# Altium project AC-DC-Supply-M1.PrjPcb
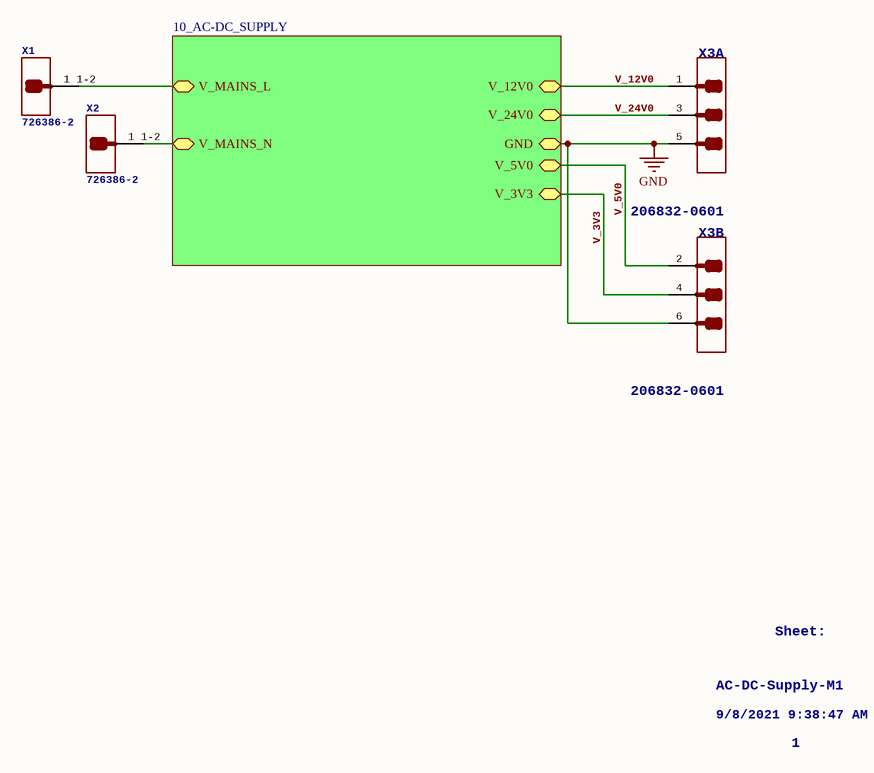
[diagram p0: AC-DC-Supply-M1.SchDoc]
2 sheets, 58 parts. Net scope: hierarchical (ports join the sheet entries above them; power ports are global).
Board file: AC-DC-Supply-M1.PcbDoc
Sheets:
  AC-DC-Supply-M1.SchDoc
    10_AC-DC_SUPPLY = AC-DC_SUPPLY.SchDoc

## Sheet AC-DC-Supply-M1.SchDoc: AC-DC-Supply-M1
size 282 x 208 mm; Date: 9/8/2021 9:38:47 AM; SheetNumber: 1; GateName_1: G$1; SymbolName_1: A4L-LOC; LibraryName: frames; DeviceSetName: A4L-LOC; Sheet: Sheet:

### Parts
X1  726386-2  [TE_726386-2_MODIFIED]
X2  726386-2  [TE_726386-2_MODIFIED]
X3  MOLEX_206832-0601MOLEX_206832-0601  [MOLEX_206832-0601]  (value not drawn)  (parts A,B of 2)

### Sub-sheets
10_AC-DC_SUPPLY = AC-DC_SUPPLY.SchDoc: V_MAINS_L (bidir), V_MAINS_N (bidir), V_24V0 (bidir), V_12V0 (bidir), V_5V0 (bidir), V_3V3 (bidir), GND (bidir)

### Nets
GND: X3.5 X3.6 ; sheet 10_AC-DC_SUPPLY/GND
V_3V3: X3.4 ; sheet 10_AC-DC_SUPPLY/V_3V3
V_5V0: X3.2 ; sheet 10_AC-DC_SUPPLY/V_5V0
V_12V0: X3.1 ; sheet 10_AC-DC_SUPPLY/V_12V0
V_24V0: X3.3 ; sheet 10_AC-DC_SUPPLY/V_24V0
NetC1_1: X1.1_1-2 ; sheet 10_AC-DC_SUPPLY/V_MAINS_L
NetC1_2: X2.1_1-2 ; sheet 10_AC-DC_SUPPLY/V_MAINS_N

### Notes on the sheet
- Sheet:
- AC-DC-Supply-M1
- 9/8/2021 9:38:47 AM
- 1
- 2
- 3
- 4
- 5
- 6
- A
- B
- C
- D

### Library data of the parts
X1 X2 = 726386-2: Terminals, Faston, GDS-Flachstecker 6.3x0.8mm, TE; MFR: TE Connectivity; PART_VALUE: 6.35mmx8mm; GateName_1: G$0; DESCRIPTION: 0.250" (6.35mm) Quick Connect Male - Solder Connector Non-Insulated; SymbolName_1: 726386-2; LibraryName: Labops_Lib_AH; DeviceSetName: 726386-2; MFN: 726386-2; PRICE-1: 0.24; SUPPLIER-1: Digikey
X3 = MOLEX_206832-0601MOLEX_206832-0601: Connector Header Through Hole 6 position 0.118" (3.00mm); MFR: Molex; PART_VALUE: 6CCT x 2Row; GateName_1: A; SymbolName_1: MOLEX_206832-0601_0_0; GateName_2: B; SymbolName_2: MOLEX_206832-0601_0_1; DESCRIPTION: Connector Header Through Hole 6 position 3mm Microfit; LIB_STATUS: Prototype; OUR_STOCK: 20; DeviceName: MOLEX_206832-0601; LibraryName: Labops_Lib_AH; DeviceSetName: MOLEX_206832-0601; 206832-0601: 206832-0601; MFN: 206832-0601; PRICE-1: 1.32; SUPPLIER-1: Digikey

## Sheet AC-DC_SUPPLY.SchDoc: AC-DC-Supply-M1
size 282 x 220 mm; Date: 9/8/2021 9:38:51 AM; SheetNumber: 1; GateName_1: G$1; SymbolName_1: A4L-LOC; LibraryName: frames; DeviceSetName: A4L-LOC; Sheet: Sheet:
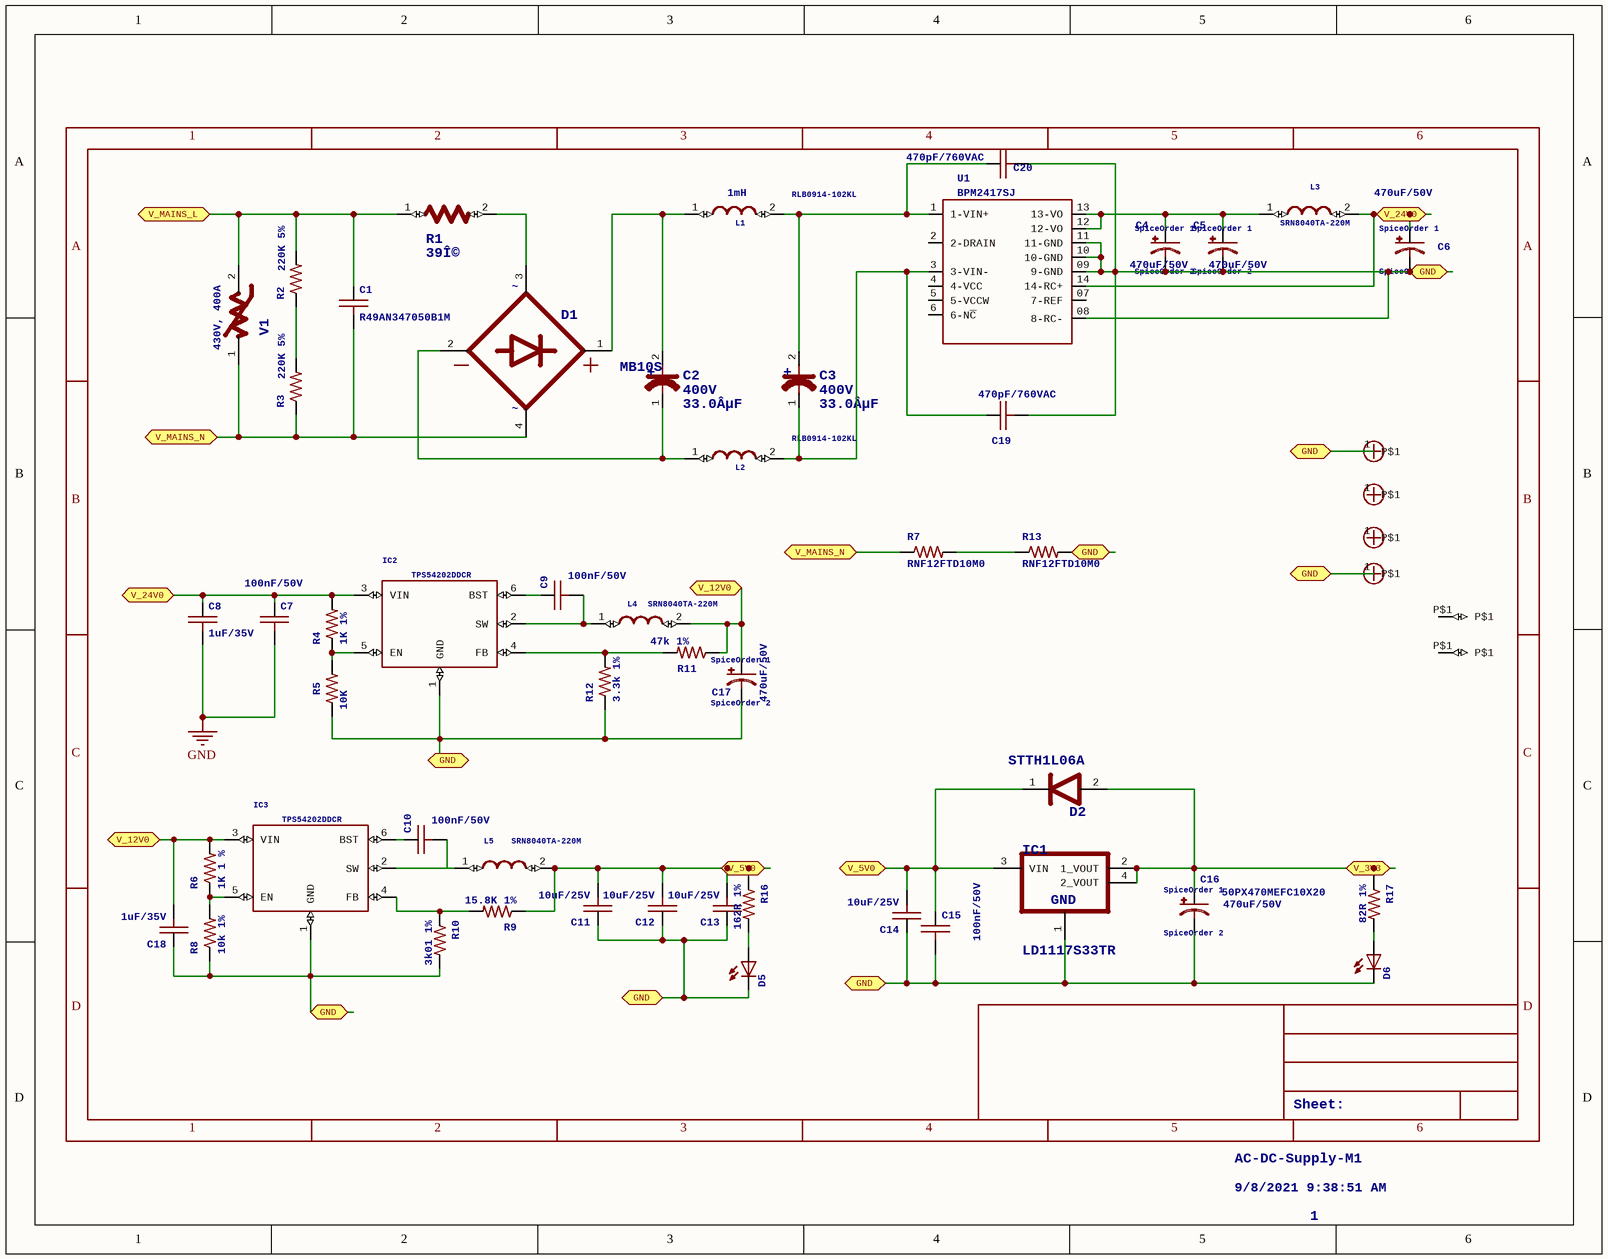
[diagram p1: AC-DC_SUPPLY.SchDoc]

### Parts
C1  R49AN347050B1M  [R49AN347050B1M]
C2  860011378008  [RADIAL_D13.0P5.0H25.0]  (value not drawn)
C3  860011378008  [RADIAL_D13.0P5.0H25.0]  (value not drawn)
C4  SpiceOrder1: SpiceOrder 1  SpiceOrder2: SpiceOrder 2  PART_VALUE: 470uF/50V  [CAPACITOR-ELKO-RM5-10X16]  (hidden comment: 50PX470MEFC10X20)
C5  SpiceOrder1: SpiceOrder 1  SpiceOrder2: SpiceOrder 2  PART_VALUE: 470uF/50V  [CAPACITOR-ELKO-RM5-10X16]  (hidden comment: 50PX470MEFC10X20)
C6  SpiceOrder1: SpiceOrder 1  SpiceOrder2: SpiceOrder 2  PART_VALUE: 470uF/50V  [CAPACITOR-ELKO-RM5-10X16]  (hidden comment: 50PX470MEFC10X20)
C7  100nF/50V  [0603]
C8  1uF/35V  [0603]
C9  100nF/50V  [0603]
C10  100nF/50V  [0603]
C11  10uF/25V  [0603]
C12  10uF/25V  [0603]
C13  10uF/25V  [0603]
C14  10uF/25V  [0603]
C15  100nF/50V  [0603]
C16  50PX470MEFC10X20  SpiceOrder1: SpiceOrder 1  SpiceOrder2: SpiceOrder 2  PART_VALUE: 470uF/50V  [CAPACITOR-ELKO-RM5-10X16]
C17  SpiceOrder1: SpiceOrder 1  SpiceOrder2: SpiceOrder 2  PART_VALUE: 470uF/50V  [CAPACITOR-ELKO-RM5-10X16]  (hidden comment: 50PX470MEFC10X20)
C18  1uF/35V  [0603]
C19  PART_VALUE: 470pF/760VAC  [CAP-P12.5-H15-W4-D1]  (hidden comment: ERP610W471MEF0)
C20  PART_VALUE: 470pF/760VAC  [CAP-P12.5-H15-W4-D1]  (hidden comment: ERP610W471MEF0)
D1  MB10S  [SOIC4W]
D2  STTH1L06ASTMICROELECTRONICS_STTH1L06A_0_0  [SMA_STTH1L06A]  (value not drawn)
D5  26-21/GPC-F3138B/CA  [SMD1206-LED]  (value not drawn)
D6  26-21/GPC-F3138B/CA  [SMD1206-LED]  (value not drawn)
FID1  FIDUCIAL  [FIDUCIAL]  (value not drawn)
FID2  FIDUCIAL  [FIDUCIAL]  (value not drawn)
IC1  LD1117S33TR  [SOT223_LD1117S33TR]
IC2  TPS54202DDCR  [SOT23-6]
IC3  TPS54202DDCR  [SOT23-6]
L1  RLB0914-102KL  PART_VALUE: 1mH  [THTINDUCTOR8MM7]
L2  RLB0914-102KL  [THTINDUCTOR8MM7]
L3  SRN8040TA-220M  [SRN8040TA-220M]
L4  SRN8040TA-220M  [SRN8040TA-220M]
L5  SRN8040TA-220M  [SRN8040TA-220M]
M1  M_HOLE_3M  [PCB_SCREW_M3_POWER]  (value not drawn)
M2  M_HOLE_3M  [PCB_SCREW_M3_POWER]  (value not drawn)
M3  M_HOLE_3M  [PCB_SCREW_M3_POWER]  (value not drawn)
M4  M_HOLE_3M  [PCB_SCREW_M3_POWER]  (value not drawn)
R1  ERG-2SJ390V  [ERG-2SJ390V_0]  (value not drawn)
R2  PART_VALUE: 220K 5%  [R1206]  (hidden comment: R_1206)
R3  PART_VALUE: 220K 5%  [R1206]  (hidden comment: R_1206)
R4  1K 1%  [R0603]
R5  10K  [R0603]
R6  1K 1 %  [R0603]
R7  RNF12FTD10M0  [RES-RM12.5-VR37]
R8  10k 1%  [R0603]
R9  15.8K 1%  [R0603]
R10  3k01 1%  [R0603]
R11  47k 1%  [R0603]
R12  3.3k 1%  [R0603]
R13  RNF12FTD10M0  [RES-RM12.5-VR37]
R16  162R 1%  [R0603]
R17  82R 1%  [R0603]
U1  BPM2417SJ  [BPM2417SJ]
V1  PART_VALUE: 430V, 400A  [EPCOS_B72205S0271K101_0]  (hidden comment: B72205S0271K101)

### Ports
GND, V_3V3, V_5V0, V_12V0, V_24V0, V_MAINS_L, V_MAINS_N

### Nets
GND: C4.2(-) C5.2(-) C6.2(-) C7.2 C8.2 C11.1 C12.1 C13.1 C14.1 C15.2 C16.2(-) C17.2(-) C18.1 C19.P$2 C20.P$2 D5.2(C) D6.2(C) IC1.1(GND) IC2.1(GND) IC3.1(GND) M1.1(P$1) M4.1(P$1) R5.1 R8.1 R10.2 R12.1 R13.2 U1.08(8-RC-) U1.09(9-GND) U1.10(10-GND) U1.11(11-GND) ; port GND
V_3V3: C16.1(+) D2.2(ANODE) IC1.2(1_VOUT) IC1.4(2_VOUT) R17.1 ; port V_3V3
V_5V0: C11.2 C12.2 C13.2 C14.2 C15.1 D2.1(CATHODE) IC1.3(VIN) L5.2(P$2) R9.1 R16.1 ; port V_5V0
V_12V0: C17.1(+) C18.2 IC3.3(VIN) L4.2(P$2) R6.2 R11.1 ; port V_12V0
V_24V0: C6.1(+) C7.1 C8.1 IC2.3(VIN) L3.2(P$2) R4.2 U1.14(14-RC+) ; port V_24V0
NetC1_1: C1.1 R1.1 R2.2 V1.2 ; port V_MAINS_L
NetC1_2: C1.2 D1.4(2_~) R3.1 R7.1 V1.1 ; port V_MAINS_N
NetC2_1: C2.1(CATHODE) D1.2(-) L2.1(P$1)
NetC2_2: C2.2(ANODE) D1.1(+) L1.1(P$1)
NetC3_1: C3.1(CATHODE) C19.P$1 L2.2(P$2) U1.3(3-VIN-)
NetC3_2: C3.2(ANODE) C20.P$1 L1.2(P$2) U1.1(1-VIN+)
NetC4_1: C4.1(+) C5.1(+) L3.1(P$1) U1.12(12-VO) U1.13(13-VO)
NetC9_1: C9.1 IC2.6(BST)
NetC9_2: C9.2 IC2.2(SW) L4.1(P$1)
NetC10_1: C10.1 IC3.6(BST)
NetC10_2: C10.2 IC3.2(SW) L5.1(P$1)
NetD1_3: D1.3(1_~) R1.2
NetD5_1: D5.1(A) R16.2
NetD6_1: D6.1(A) R17.2
NetIC2_4: IC2.4(FB) R11.2 R12.2
NetIC2_5: IC2.5(EN) R4.1 R5.2
NetIC3_4: IC3.4(FB) R9.2 R10.1
NetIC3_5: IC3.5(EN) R6.1 R8.2
NetR2_1: R2.1 R3.2
NetR7_2: R7.2 R13.1

Not connected (* = marked no-connect by the designer): FID1 P$1; FID2 P$1; M2 1(P$1); M3 1(P$1); U1 2(2-DRAIN) 4(4-VCC) 5(5-VCCW) 6(6-N~{C}) 07(7-REF)

### Notes on the sheet
- Sheet:
- AC-DC-Supply-M1
- 9/8/2021 9:38:51 AM
- 1
- 2
- 3
- 4
- 5
- 6
- A
- B
- C
- D

### Library data of the parts
C1 = R49AN347050B1M: 0.47ÂµF X Cap 330V 800V Polypropylene (PP), Metallized Radial; MFR: Kemet; PART_VALUE: 470nF/330VAC; GateName_1: G$1; SymbolName_1: CAP_NON_POLARIZED; DESCRIPTION: Film,X1,470nF/330Vac,THT; LIB_STATUS: Verified; OUR_STOCK: 8; LibraryName: Labops_Lib_AH; DeviceSetName: R49AN347050B1M; MFN: R49AN347050B1M; PRICE-1: 1.51; SUPPLIER-1: Digikey
C2 C3 = 860011378008: Aluminium Electrolytic Capacitor, WCAP-ATG8 Series, 33 F, 20%, 400 V, 13 mm, Radial Leaded; MFR: Wurth Elektronik; PART_VALUE: 33uF/400V; GateName_1: G$0; SymbolName_1: WURTH_860011378008_0_0; DESCRIPTION: Electrolytic Cap 33µF 400V 13mm Radial WCAP-ATG8; Lifetime 2000h +85°C; LIB_STATUS: Verified; OUR_STOCK: 4; LibraryName: Labops_Lib_AH; DeviceSetName: 860011378008; 33.0ÂµF: 33.0ÂµF; +: +; 400V: 400V; MFN: 860011378008; SUPPLIER-1: Digikey
C4-C6 C16 C17 = 50PX470MEFC10X20: Electrolytic Cap, 470ÂµF, 25V, Low ESR, Kemet, Pitch=5mm, Dia=10mm, L=12,5mm; MFR: Rubicon; GateName_1: G$1; SymbolName_1: CAP_POLARIZED; DESCRIPTION: 470uF ±20% 50V 10mm 20mm 5mm 2000Hrs; LIB_STATUS: Prototype; OUR_STOCK: 20; LibraryName: Labops_Lib_AH; DeviceSetName: 50PX470MEFC10X20; MFN: 50PX470MEFC10X20; PRICE-1: 0.14; SUPPLIER-1: LCSC; TECHNOLOGY: THT
C7-C15 C18 = C_0603: GateName_1: G$1; SymbolName_1: CAP_NON_POLARIZED; MFN: Open Source; LibraryName: Labops_Lib_AH; DeviceSetName: C_0603; DESCRIPTION: *; MFR: *; OUR-STOCK: *; PART_VALUE: *; PRICE-1: *; SUPPLIER-1: *
C19 C20 = ERP610W471MEF0: MFR: Kemet; GateName_1: G$1; SymbolName_1: CAP_NON_POLARIZED; DESCRIPTION: 470 pF ±20% 760VAC Ceramic Capacitor Y5U (E) Radial X1,Y1; LIB_STATUS: Prototype; OUR_STOCK: 150; LibraryName: Labops_Lib_AH; DeviceSetName: ERP610W471MEF0; MFN: ERP610W471MEF0; PRICE-1: 0.42; SUPPLIER-1: Digikey
D1 = MB10S: MFR: On Semi, Diodes,MDD; PART_VALUE: Bridge Rectifier; GateName_1: G$1; DESCRIPTION: 0.5 A 1000 V Low Leakage SMT Bridge Rectifier - SOIC-4; LIB_STATUS: Prototype; SymbolName_1: MB10S; LibraryName: Labops_Lib_AH; DeviceSetName: MB10S; MB10S: MB10S; ~: ~; MFN: MB10S; PRICE-1: 0.02; STOCK: 10; SUPPLIER-1: Digikey
D2 = STTH1L06ASTMICROELECTRONICS_STTH1L06A_0_0: Diode Standard 600V 1A Surface Mount SMA; GateName_1: G$0; CENTROID_NOT_SPECIFIED: No; DEVICE_CLASS_L1: Discrete Semiconductors; DEVICE_CLASS_L2: Diodes; DEVICE_CLASS_L3: Rectifier Diodes; LEAD_FREE: Yes; MAX_JUNCTION_TEMP: +175°C; MAX_SURGE_FORWARD_CURRENT: 20A; MFG_PACKAGE_IDENT_COMPONENT_ID: 68520089bca91e26; MFG_PACKAGE_IDENT_REV: 0; PEAK_REVERSE_CURRENT: 1uA; PREFIX: D; STANDOFF_HEIGHT: 0.05mm; VERIFICATION_VERSION: 0.0.0.3; SymbolName_1: STTH1L06A; DeviceName: STMICROELECTRONICS_STTH1L06A_0_0; LibraryName: Labops_Lib_AH; DeviceSetName: STTH1L06A; STTH1L06A: STTH1L06A; AUTOMOTIVE: No; DATASHEET: https://www.st.com/content/ccc/resource/technical/document/datasheet/e9/c2/09/e3/32/47/44/bd/CD00002694.pdf/files/CD00002694.pdf/jcr:content/translations/en.CD00002694.pdf; DIGIKEY_DESCRIPTION: DIODE GEN PURP 600V 1A SMA; DIGIKEY_PART_NUMBER: 497-3241-2-ND; FOOTPRINT_VARIANT_NAME_0: Recommended_Land_Pattern; FORWARD_CURRENT: 1A; HEIGHT: 2.65mm; MAX_REPETITIVE_REVERSE_VOLTAGE: 600V; MF: STMicroelectronics; MFG_PACKAGE_IDENT: SMA; MFG_PACKAGE_IDENT_DATE: 0; MOUSER_DESCRIPTION: DIODE GEN PURP 600V 1A SMA; MOUSER_PART_NUMBER: 511-STTH1L06A; MPN: STTH1L06A; PACKAGE: SMA; ROHS: Yes; TEMPERATURE_RANGE_HIGH: +175°C
D5 D6 = 26-21/GPC-F3138B/CA: MFR: Everlight; PART_VALUE: Green LED; GateName_1: G$1; SymbolName_1: LED_0805_GREEN; DESCRIPTION: Green SMD LED 1206, 160mcd; LIB_STATUS: Prototype; OUR_STOCK: 50; LibraryName: Labops_Lib_AH; DeviceSetName: 26-21/GPC-F3138B/CA; MFN: 26-21/GPC-F3138B/CA; PRICE-1: 0.06; SUPPLIER-1: LCSC
FID1 FID2 = FIDUCIAL: GateName_1: G$1; SymbolName_1: FIDUCIAL; LibraryName: Labops_Lib_AH; DeviceSetName: FIDUCIAL
IC1 = LD1117S33TR: IC REG LINEAR 3.3V 800mA SOT223; MFR: STmicro, Diodes, TI,; PART_VALUE: xx1117x33xx; GateName_1: G$1; DESCRIPTION: LDO,Fixed 15V 3.3V 1.3V; LIB_STATUS: Verified; OUR_STOCK: 10; SymbolName_1: LD1117S33TR; LibraryName: Labops_Lib_AH; DeviceSetName: LD1117S33TR; GND: GND; LD1117S33TR: LD1117S33TR; MFN: LD1117S33TR; PRICE_1: 0.07; SUPPLIER-1: LCSC
IC2 IC3 = TPS54202DDCR: MFR: Texas Instruments; GateName_1: G$1; DESCRIPTION: 2A 28V SOT-23-6 Sync Buck; LIB_STATUS: Prototype; OUR_STOCK: 40; SymbolName_1: TPS54202; LibraryName: Labops_Lib_AH; DeviceSetName: TPS54202DDCR; MFN: TPS54202DDCR; PART_VALUE: TPS54202; PRICE-1: 1.8; SUPPLIER-1: LCSC
L1 = RLB0914-102KL: MFR: Bourns; GateName_1: G$1; SymbolName_1: INDUCTOR_2_PINS; DESCRIPTION: Inductor Power Wirewound 1mH 10% 252KHz 40Q-Factor Ferrite 300mA 2.1Ohm; LIB_STATUS: Prototype; OUR_STOCK: 0; LibraryName: Labops_Lib_AH; DeviceSetName: RLB0914-102KL; MFN: RLB0914-102KL; PRICE-1: 0.42; SUPPLIER-1: Digikey
L2 = RLB0914-102KL: MFR: Bourns; PART_VALUE: 1mH; GateName_1: G$1; SymbolName_1: INDUCTOR_2_PINS; DESCRIPTION: Inductor Power Wirewound 1mH 10% 252KHz 40Q-Factor Ferrite 300mA 2.1Ohm; LIB_STATUS: Prototype; OUR_STOCK: 0; LibraryName: Labops_Lib_AH; DeviceSetName: RLB0914-102KL; MFN: RLB0914-102KL; PRICE-1: 0.42; SUPPLIER-1: Digikey
L3-L5 = SRN8040TA-220M: FIXED IND 22UH 2.9A SMD, 73m-Ohm, Bourns; PART_VALUE: 22uH/2.9A; GateName_1: G$1; SymbolName_1: INDUCTOR_2_PINS; LIB_STATUS: Verified; OUR_STOCK: 10; LibraryName: Labops_Lib_AH; DeviceSetName: SRN8040TA-220M; MFN: SRN8040TA-220M; MFR: Bourns; PRICE-1: *; SUPPLIER-1: Digikey; TECHNOLOGY: SMD
M1-M4 = M_HOLE_3M: GateName_1: G$1; SymbolName_1: M_HOLE; LibraryName: Labops_Lib_AH; DeviceSetName: M_HOLE_3M
R1 = ERG-2SJ390V: RES 39 OHM 2W 5% AXIAL, Metal Oxide, Panasonic; GateName_1: G$1; SymbolName_1: ERG-2SJ390V_0_0; LibraryName: Labops_Lib_AH; DeviceSetName: ERG-2SJ390V; 39Î©: 39Î©
R2 R3 = R_1206: MFR: Vishay; GateName_1: G$1; SymbolName_1: R-US; LIB_STATUS: Verified; MFN: CRCW1206220KJNEAHP; LibraryName: Labops_Lib_AH; DeviceSetName: R_1206; DESCRIPTION: *; OUR-STOCK: *; PRICE-1: *; SUPPLIER-1: *
R4-R6 R8-R12 R16 R17 = R_0603: GateName_1: G$1; SymbolName_1: R-US; MFN: Open Source; LibraryName: Labops_Lib_AH; DeviceSetName: R_0603; DESCRIPTION: *; LIB_STATUS: *; MFR: *; OUR_STOCK: *; PART_VALUE: *; PRICE-1: *; SUPPLIER-1: *
R7 R13 = RNF12FTD10M0: MFR: Stackpole Electronics Inc; PART_VALUE: 10Meg 5%; GateName_1: G$1; SymbolName_1: R-US; DESCRIPTION: 10 MOhms ±1% 0.5W, 1/2W Through Hole Resistor Axial Flame Retardant Coating, Safety Metal Film; LIB_STATUS: Prototype; OUR-STOCK: 20; LibraryName: Labops_Lib_AH; DeviceSetName: RNF12FTD10M0; MFN: RNF12FTD10M0; PRICE-1: 0.29; SUPPLIER-1: Digikey
U1 = BPM2417SJ: MFR: Tamura; PART_VALUE: Power Sources; GateName_1: G$1; DESCRIPTION: Ac/Dc Power Supply Module; LIB_STATUS: Prototype; OUR_STOCK: 5; SymbolName_1: BPM2417SJ; LibraryName: Labops_Lib_AH; DeviceSetName: BPM2417SJ; MFN: BPM2417SJ; PRICE-1: 7.00; SUPPLIER-1: Digikey
V1 = B72205S0271K101: VARISTOR 205V 800A DISC 5MM; MFR: EPCOS; GateName_1: G$1; LIB_STATUS: Verified; MFN: B72205S0271K1011; OUR_STOCK: 10; SymbolName_1: VARISTOR; LibraryName: Labops_Lib_AH; DeviceSetName: B72205S0271K101; PRICE-1: 0.31; SUPPLIER-1: Digikey

## Nets that join several sheets
GND: AC-DC-Supply-M1 (X3.5 X3.6), AC-DC_SUPPLY (31 pins)
NetC1_1: AC-DC-Supply-M1 (X1.1 1-2), AC-DC_SUPPLY (C1.1 R1.1 R2.2 V1.2)
NetC1_2: AC-DC-Supply-M1 (X2.1 1-2), AC-DC_SUPPLY (5 pins)
V_3V3: AC-DC-Supply-M1 (X3.4), AC-DC_SUPPLY (5 pins)
V_5V0: AC-DC-Supply-M1 (X3.2), AC-DC_SUPPLY (10 pins)
V_12V0: AC-DC-Supply-M1 (X3.1), AC-DC_SUPPLY (6 pins)
V_24V0: AC-DC-Supply-M1 (X3.3), AC-DC_SUPPLY (7 pins)